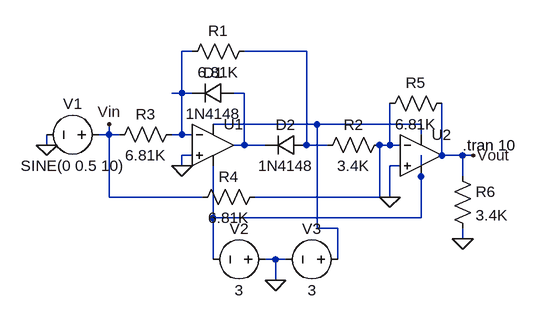
[diagram p0: schematic Precision Rectifier(full wave).asc]
Precision Rectifier(full wave).asc, the LTspice schematic file:
Version 4.1
SHEET 1 880 680
WIRE 128 0 112 0
WIRE 304 0 208 0
WIRE 112 64 112 0
WIRE 112 64 96 64
WIRE 128 64 112 64
WIRE 208 64 192 64
WIRE 320 112 160 112
WIRE 480 112 320 112
WIRE 0 128 0 112
WIRE 0 128 -16 128
WIRE 16 128 0 128
WIRE 112 128 112 64
WIRE 112 128 96 128
WIRE 128 128 112 128
WIRE 480 128 480 112
WIRE -96 144 -96 128
WIRE 208 144 208 64
WIRE 208 144 192 144
WIRE 240 144 208 144
WIRE 304 144 304 0
WIRE 336 144 304 144
WIRE 432 144 432 80
WIRE 432 144 416 144
WIRE 448 144 432 144
WIRE 128 160 112 160
WIRE 512 160 512 80
WIRE 544 160 512 160
WIRE 560 160 544 160
WIRE 112 176 112 160
WIRE 448 176 432 176
WIRE 480 192 480 160
WIRE 544 192 544 160
WIRE 0 224 0 128
WIRE 144 224 0 224
WIRE 416 224 416 144
WIRE 416 224 224 224
WIRE 432 224 432 176
WIRE 160 256 160 176
WIRE 480 256 480 192
WIRE 480 256 160 256
WIRE 320 272 320 112
WIRE 352 272 320 272
WIRE 544 288 544 272
WIRE 160 320 160 256
WIRE 256 320 240 320
WIRE 272 320 256 320
WIRE 352 320 352 272
WIRE 256 352 256 320
FLAG 544 288 0
FLAG 432 224 0
FLAG 112 176 0
FLAG -96 144 0
FLAG 0 112 Vin
FLAG 560 160 Vout
FLAG 256 352 0
SYMBOL OpAmps\\UniversalOpAmp2 160 144 R0
SYMATTR InstName U1
SYMBOL diode 192 48 R90
WINDOW 0 0 32 VBottom 2
WINDOW 3 32 32 VTop 2
SYMATTR InstName D1
SYMATTR Value 1N4148
SYMBOL diode 304 128 R90
WINDOW 0 0 32 VBottom 2
WINDOW 3 32 32 VTop 2
SYMATTR InstName D2
SYMATTR Value 1N4148
SYMBOL OpAmps\\UniversalOpAmp2 480 160 R0
SYMATTR InstName U2
SYMBOL voltage 0 128 R90
WINDOW 0 -32 56 VBottom 2
WINDOW 3 32 56 VTop 2
WINDOW 123 0 0 Left 0
WINDOW 39 0 0 Left 0
SYMATTR InstName V1
SYMATTR Value SINE(0 0.5 10)
SYMBOL res 224 -16 R90
WINDOW 0 0 56 VBottom 2
WINDOW 3 32 56 VTop 2
SYMATTR InstName R1
SYMATTR Value 6.81K
SYMATTR SpiceLine tol=1 pwr=0.1
SYMBOL res 432 128 R90
WINDOW 0 0 56 VBottom 2
WINDOW 3 32 56 VTop 2
SYMATTR InstName R2
SYMATTR Value 3.4K
SYMATTR SpiceLine tol=1 pwr=0.1
SYMBOL res 112 112 R90
WINDOW 0 0 56 VBottom 2
WINDOW 3 32 56 VTop 2
SYMATTR InstName R3
SYMATTR Value 6.81K
SYMATTR SpiceLine tol=1 pwr=0.1
SYMBOL res 240 208 R90
WINDOW 0 0 56 VBottom 2
WINDOW 3 32 56 VTop 2
SYMATTR InstName R4
SYMATTR Value 6.81K
SYMATTR SpiceLine tol=1 pwr=0.1
SYMBOL res 528 64 R90
WINDOW 0 0 56 VBottom 2
WINDOW 3 32 56 VTop 2
SYMATTR InstName R5
SYMATTR Value 6.81K
SYMATTR SpiceLine tol=1 pwr=0.1
SYMBOL voltage 256 320 R90
WINDOW 0 -32 56 VBottom 2
WINDOW 3 32 56 VTop 2
WINDOW 123 0 0 Left 0
WINDOW 39 0 0 Left 0
SYMATTR InstName V2
SYMATTR Value 3
SYMBOL voltage 368 320 R90
WINDOW 0 -32 56 VBottom 2
WINDOW 3 32 56 VTop 2
WINDOW 123 0 0 Left 0
WINDOW 39 0 0 Left 0
SYMATTR InstName V3
SYMATTR Value 3
SYMBOL res 528 176 R0
SYMATTR InstName R6
SYMATTR Value 3.4K
SYMATTR SpiceLine tol=1 pwr=0.1
TEXT 544 144 Left 2 !.tran 10

The netlist it stands for:
* Precision Rectifier(full wave).asc
X§U1 0 N001 N004 N006 N003 level2 Avol=1Meg GBW=10Meg Slew=10Meg Ilimit=25m Rail=0 Vos=0 En=0 Enk=0 In=0 Ink=0 Rin=500Meg  ; pins In+ In- V+ V- OUT
D1 N003 N001 1N4148
D2 N002 N003 1N4148
X§U2 0 N005 N004 N006 Vout level2 Avol=1Meg GBW=10Meg Slew=10Meg Ilimit=25m Rail=0 Vos=0 En=0 Enk=0 In=0 Ink=0 Rin=500Meg  ; pins In+ In- V+ V- OUT
V1 Vin 0 SINE(0 0.5 10)
R1 N002 N001 6.81K tol=1 pwr=0.1
R2 N005 N002 3.4K tol=1 pwr=0.1
R3 N001 Vin 6.81K tol=1 pwr=0.1
R4 N005 Vin 6.81K tol=1 pwr=0.1
R5 Vout N005 6.81K tol=1 pwr=0.1
V2 0 N006 3
V3 N004 0 3
R6 Vout 0 3.4K tol=1 pwr=0.1
.model D D
.lib standard.dio
.tran 10
.lib UniversalOpAmp2.lib
.backanno
.end